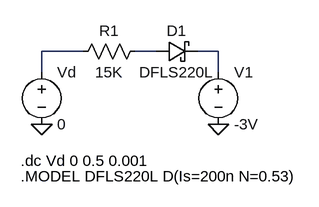
[diagram p0: schematic 5-8-b-1.asc]
5-8-b-1.asc, the LTspice schematic file:
Version 4
SHEET 1 880 680
WIRE 192 144 128 144
WIRE 304 144 272 144
WIRE 400 144 368 144
WIRE 128 176 128 144
WIRE 400 176 400 144
FLAG 128 256 0
FLAG 400 256 0
SYMBOL voltage 128 160 R0
WINDOW 123 0 0 Left 2
WINDOW 39 0 0 Left 2
SYMATTR InstName Vd
SYMATTR Value 0
SYMBOL res 288 128 R90
WINDOW 0 0 56 VBottom 2
WINDOW 3 32 56 VTop 2
SYMATTR InstName R1
SYMATTR Value 15K
SYMBOL schottky 304 160 R270
WINDOW 0 32 32 VTop 2
WINDOW 3 0 32 VBottom 2
SYMATTR InstName D1
SYMATTR Value DFLS220L
SYMATTR Description Diode
SYMATTR Type diode
SYMBOL voltage 400 160 R0
WINDOW 123 0 0 Left 2
WINDOW 39 0 0 Left 2
SYMATTR InstName V1
SYMATTR Value -3V
TEXT 96 336 Left 2 !.MODEL DFLS220L D(Is=200n N=0.53)
TEXT 96 312 Left 2 !.dc Vd 0 0.5 0.001

The netlist it stands for:
* 5-8-b-1.asc
Vd N001 0 0
R1 N002 N001 15K
D1 N002 N003 DFLS220L
V1 N003 0 -3V
.model D D
.lib standard.dio
.MODEL DFLS220L D(Is=200n N=0.53)
.dc Vd 0 0.5 0.001
.backanno
.end